# Altium schematic sheet OsciladorLocal.SchDoc
size A4
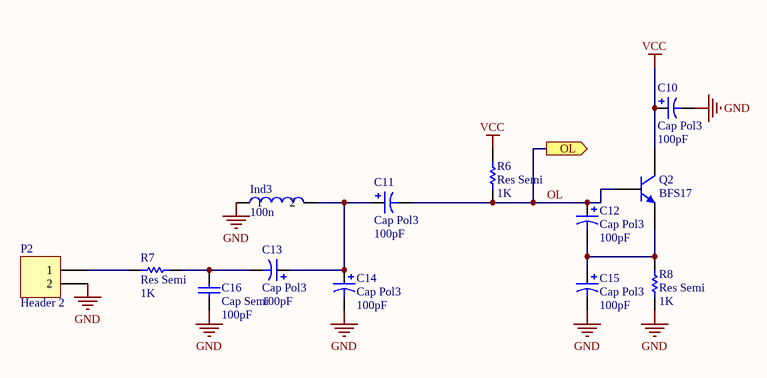
[diagram p0: OsciladorLocal.SchDoc]

## Parts
C10  Cap Pol3  value 100pF  [C0805]
C11  Cap Pol3  value 100pF  [C0805]
C12  Cap Pol3  value 100pF  [C0805]
C13  Cap Pol3  value 100pF  [C0805]
C14  Cap Pol3  value 100pF  [C0805]
C15  Cap Pol3  value 100pF  [C0805]
C16  Cap Semi  value 100pF  [C1206]
Ind3  Valor: 100n  [Ind_3mm]  (hidden comment: Ind2)
P2  Header 2  [HDR1X2]
Q2  BFS17  [SOT23_N]
R6  Res Semi  value 1K  [2012[0805]]
R7  Res Semi  value 1K  [2012[0805]]
R8  Res Semi  value 1K  [2012[0805]]

## Ports
OL (out)

## Nets
GND: C10.2 C14.2 C15.2 C16.2 Ind3.1 P2.2 R8.1
VCC: C10.1 Q2.3(C) R6.2
OL: C11.2 C12.1 Q2.1(B) R6.1 ; port OL
NetC11_1: C11.1 C13.1 C14.1 Ind3.2
NetC12_2: C12.2 C15.1 Q2.2(E) R8.2
NetC13_2: C13.2 C16.1 R7.2
NetP2_1: P2.1 R7.1

## Library data of the parts
C10-C15 = Cap Pol3: Polarized Capacitor (Surface Mount); Published: 8-Jun-2000; LatestRevisionDate: 17-Jul-2002; LatestRevisionNote: Re-released for DXP Platform.; PackageReference: C0805; Publisher: Altium Limited
C16 = Cap Semi: Capacitor (Semiconductor SIM Model); Published: 8-Jun-2000; LatestRevisionDate: 17-Jul-2002; LatestRevisionNote: Re-released for DXP Platform.; PackageReference: C1206; Publisher: Altium Limited
P2 = Header 2: Header, 2-Pin; LatestRevisionDate: 17-Jul-2002; LatestRevisionNote: Re-released for DXP Platform.; Publisher: Altium Limited
Q2 = BFS17: NPN 1 GHz Wideband Transistor; Published: 17-Sep-2003; LatestRevisionDate: 12-Dec-2006; LatestRevisionNote: IPC-7351 Footprint Added.; DatasheetVersion: Sep-1995; PackageVersion: May-1999; PackageReference: SOT23; Publisher: Altium Limited; PackageDescription: 3-Pin SOT-23 Package 0.95 mm Pitch, 2.3 mm Lead Span; ComponentLink1Description: Manufacturer Link; ComponentLink1URL: http://www.semiconductors.philips.com/; ComponentLink2Description: Datasheet; ComponentLink2URL: http://www.semiconductors.philips.com/acrobat/datasheets/BFS17_2.pdf
R6-R8 = Res Semi: Semiconductor Resistor; Published: 8-Jun-2000; LatestRevisionDate: 17-Jul-2002; LatestRevisionNote: Re-released for DXP Platform.; PackageReference: AXIAL-0.5; Publisher: Altium Limited